# Altium schematic sheet Block Diagram.SchDoc
size A4; SheetNumber: 1; SheetTotal: 8
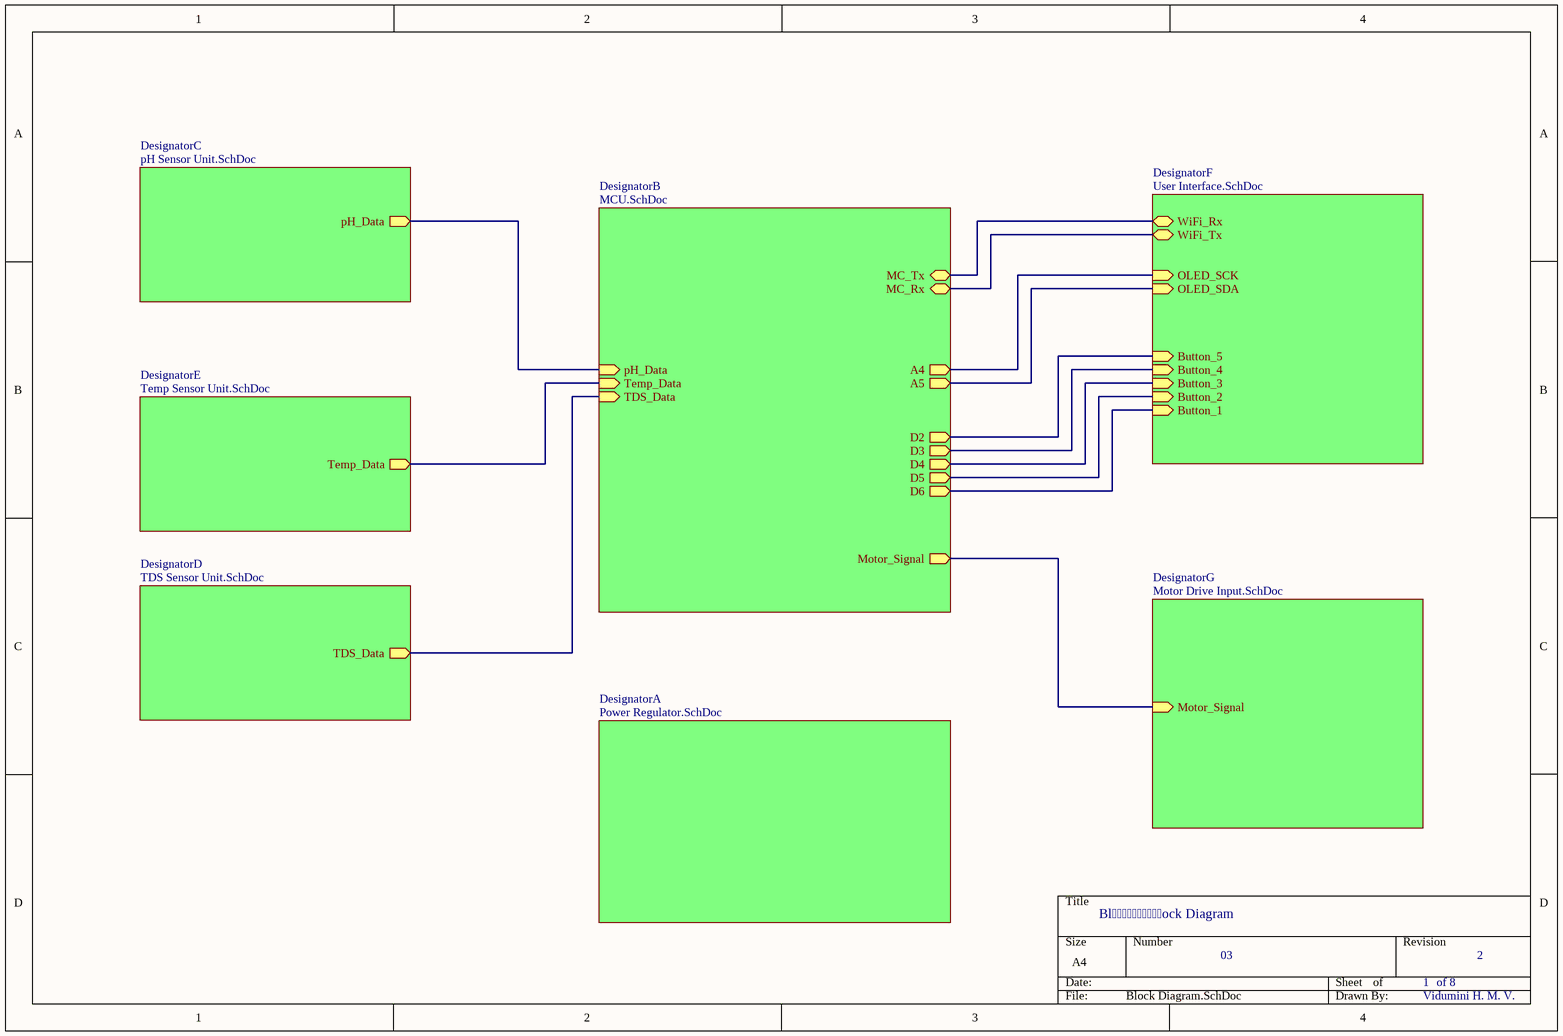
[diagram p0: Block Diagram.SchDoc]

## Sub-sheets
DesignatorA = Power Regulator.SchDoc: no entries
DesignatorB = MCU.SchDoc: pH_Data (in), Temp_Data (in), TDS_Data (in), MC_Rx (bidir), MC_Tx (bidir), A4 (out), A5 (out), D2 (out), D3 (out), D4 (out), D5 (out), D6 (out), Motor_Signal (out)
DesignatorC = pH Sensor Unit.SchDoc: pH_Data (out)
DesignatorD = TDS Sensor Unit.SchDoc: TDS_Data (out)
DesignatorE = Temp Sensor Unit.SchDoc: Temp_Data (out)
DesignatorF = User Interface.SchDoc: WiFi_Rx (bidir), WiFi_Tx (bidir), OLED_SCK (in), OLED_SDA (in), Button_5 (in), Button_4 (in), Button_3 (in), Button_2 (in), Button_1 (in)
DesignatorG = Motor Drive Input.SchDoc: Motor_Signal (in)

## Nets
(unnamed): sheet DesignatorB/pH_Data, sheet DesignatorC/pH_Data
(unnamed): sheet DesignatorB/Temp_Data, sheet DesignatorE/Temp_Data
(unnamed): sheet DesignatorB/TDS_Data, sheet DesignatorD/TDS_Data
(unnamed): sheet DesignatorB/MC_Rx, sheet DesignatorF/WiFi_Tx
(unnamed): sheet DesignatorB/MC_Tx, sheet DesignatorF/WiFi_Rx
(unnamed): sheet DesignatorB/A4, sheet DesignatorF/OLED_SCK
(unnamed): sheet DesignatorB/A5, sheet DesignatorF/OLED_SDA
(unnamed): sheet DesignatorB/D2, sheet DesignatorF/Button_5
(unnamed): sheet DesignatorB/D3, sheet DesignatorF/Button_4
(unnamed): sheet DesignatorB/D4, sheet DesignatorF/Button_3
(unnamed): sheet DesignatorB/D5, sheet DesignatorF/Button_2
(unnamed): sheet DesignatorB/D6, sheet DesignatorF/Button_1
(unnamed): sheet DesignatorB/Motor_Signal, sheet DesignatorG/Motor_Signal

## Notes on the sheet
- Block Diagram
- 03
- 1
- of 8
- 2
- Vidumini H. M. V.